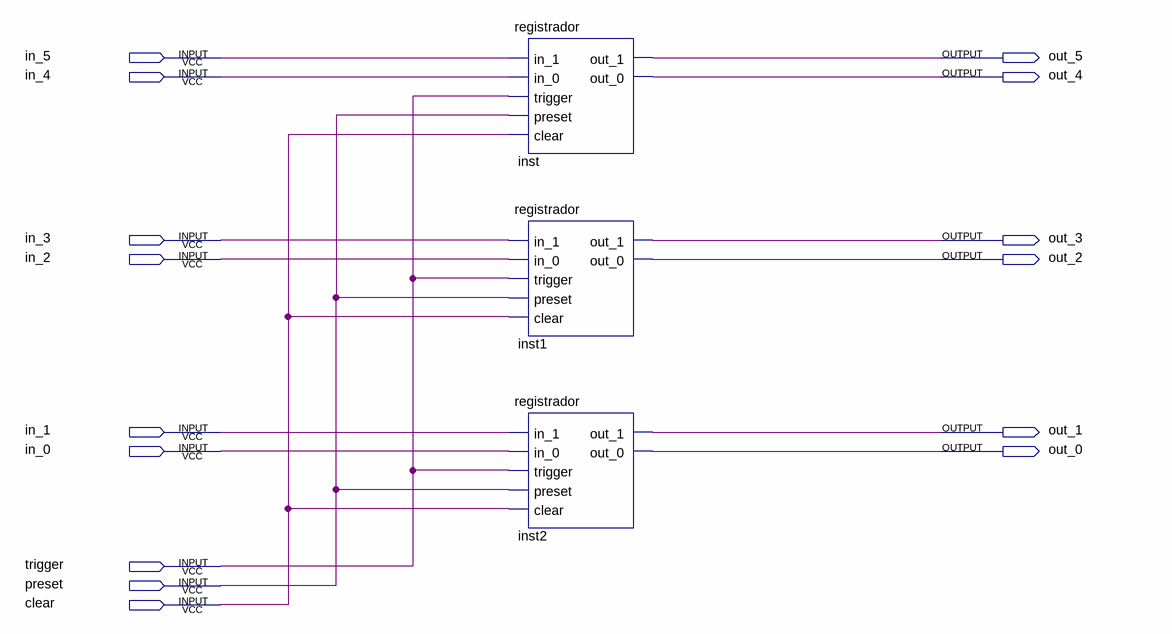
[diagram p0: schematic sheet]
// Quartus schematic mdr6b.bdf as structural Verilog: 3 symbols, 15 pins
module mdr6b (
  input  in_5,
  input  in_4,
  input  in_3,
  input  in_2,
  input  in_1,
  input  in_0,
  input  trigger,
  input  preset,
  input  clear,
  output out_5,
  output out_4,
  output out_3,
  output out_2,
  output out_1,
  output out_0
);

  registrador inst (
    .in_1(in_5), .in_0(in_4), .trigger(trigger), .preset(preset), .clear(clear), .out_1(out_5), .out_0(out_4));
  registrador inst1 (
    .in_1(in_3), .in_0(in_2), .trigger(trigger), .preset(preset), .clear(clear), .out_1(out_3), .out_0(out_2));
  registrador inst2 (
    .in_1(in_1), .in_0(in_0), .trigger(trigger), .preset(preset), .clear(clear), .out_1(out_1), .out_0(out_0));
endmodule
